# Altium schematic sheet Title.SchDoc: Hrafn
size Tabloid; Author: Nicholas Belsten; DrawnBy: Nicholas Belsten; SheetNumber: 1; SheetTotal: 10; DCN: Aika; ProgramName: AERO-VISTA; Section: Title
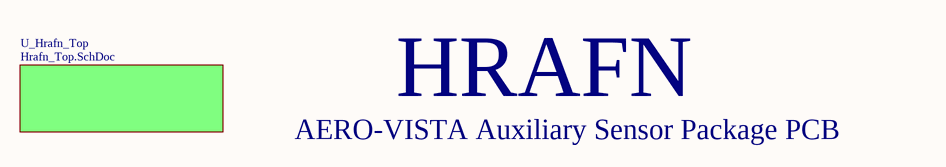
[diagram p0: Title.SchDoc]

## Sub-sheets
U_Hrafn_Top = Hrafn_Top.SchDoc: no entries

## Notes on the sheet
- HRAFN
- AERO-VISTA Auxiliary Sensor Package PCB
- Title
- Size
- Date
- Tabloid
- Section
- Time
- Sheet
- of
- Revision
- Drawn
- 33-207 / 77 Mass. Ave.
- Cambridge, MA 02139
- File